# EasyEDA Pro project ProProject_AT32_FOC_2024-04-27.epro, board AT32_FOC
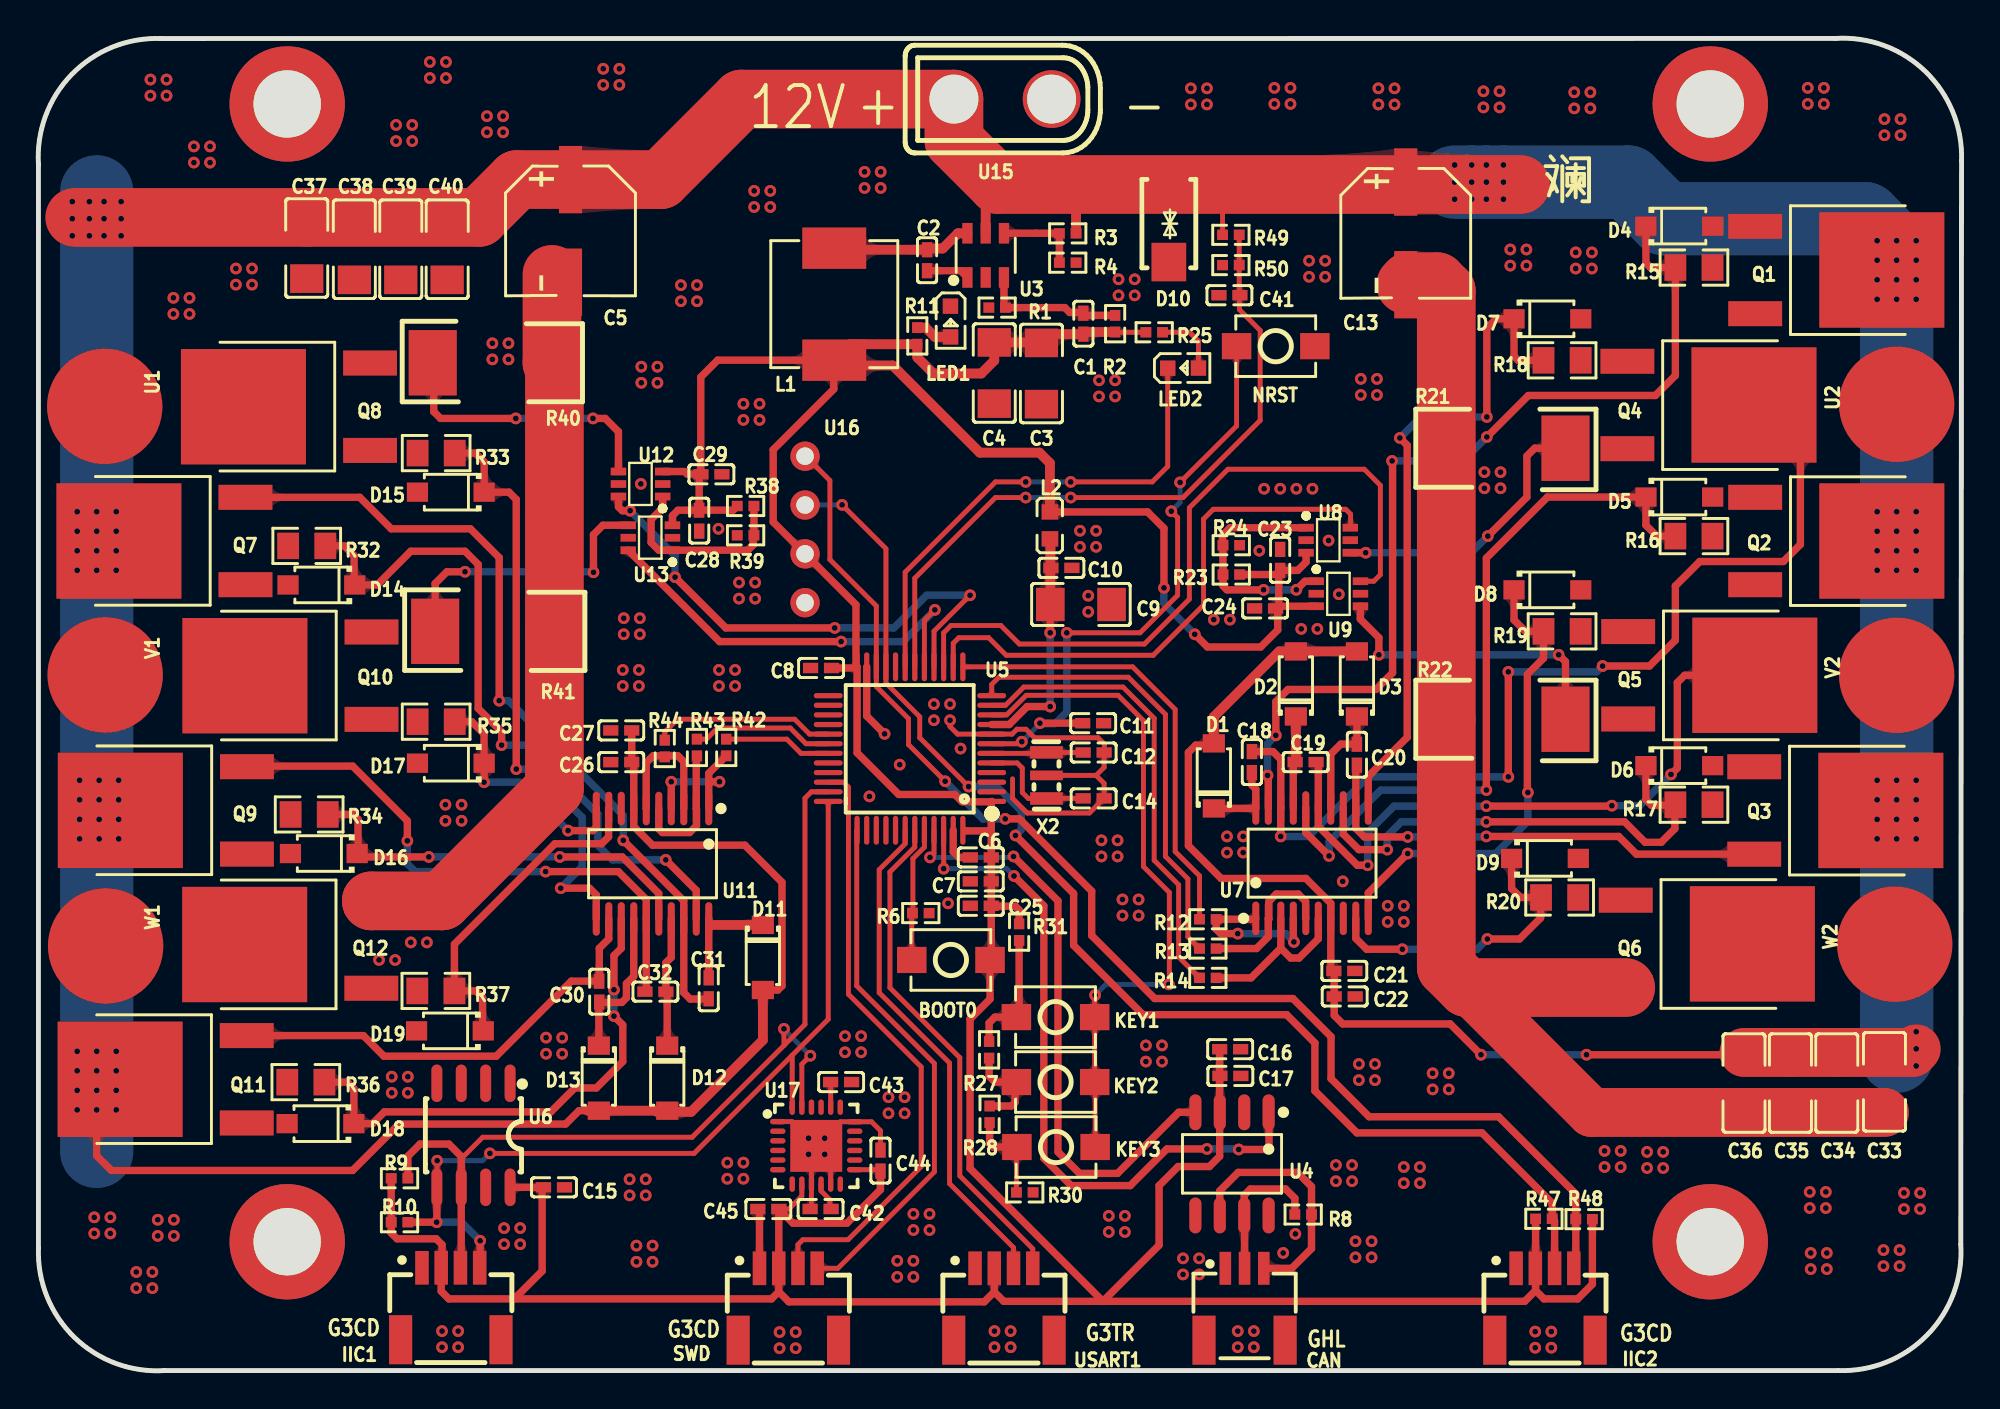
[diagram p6: board, top side]
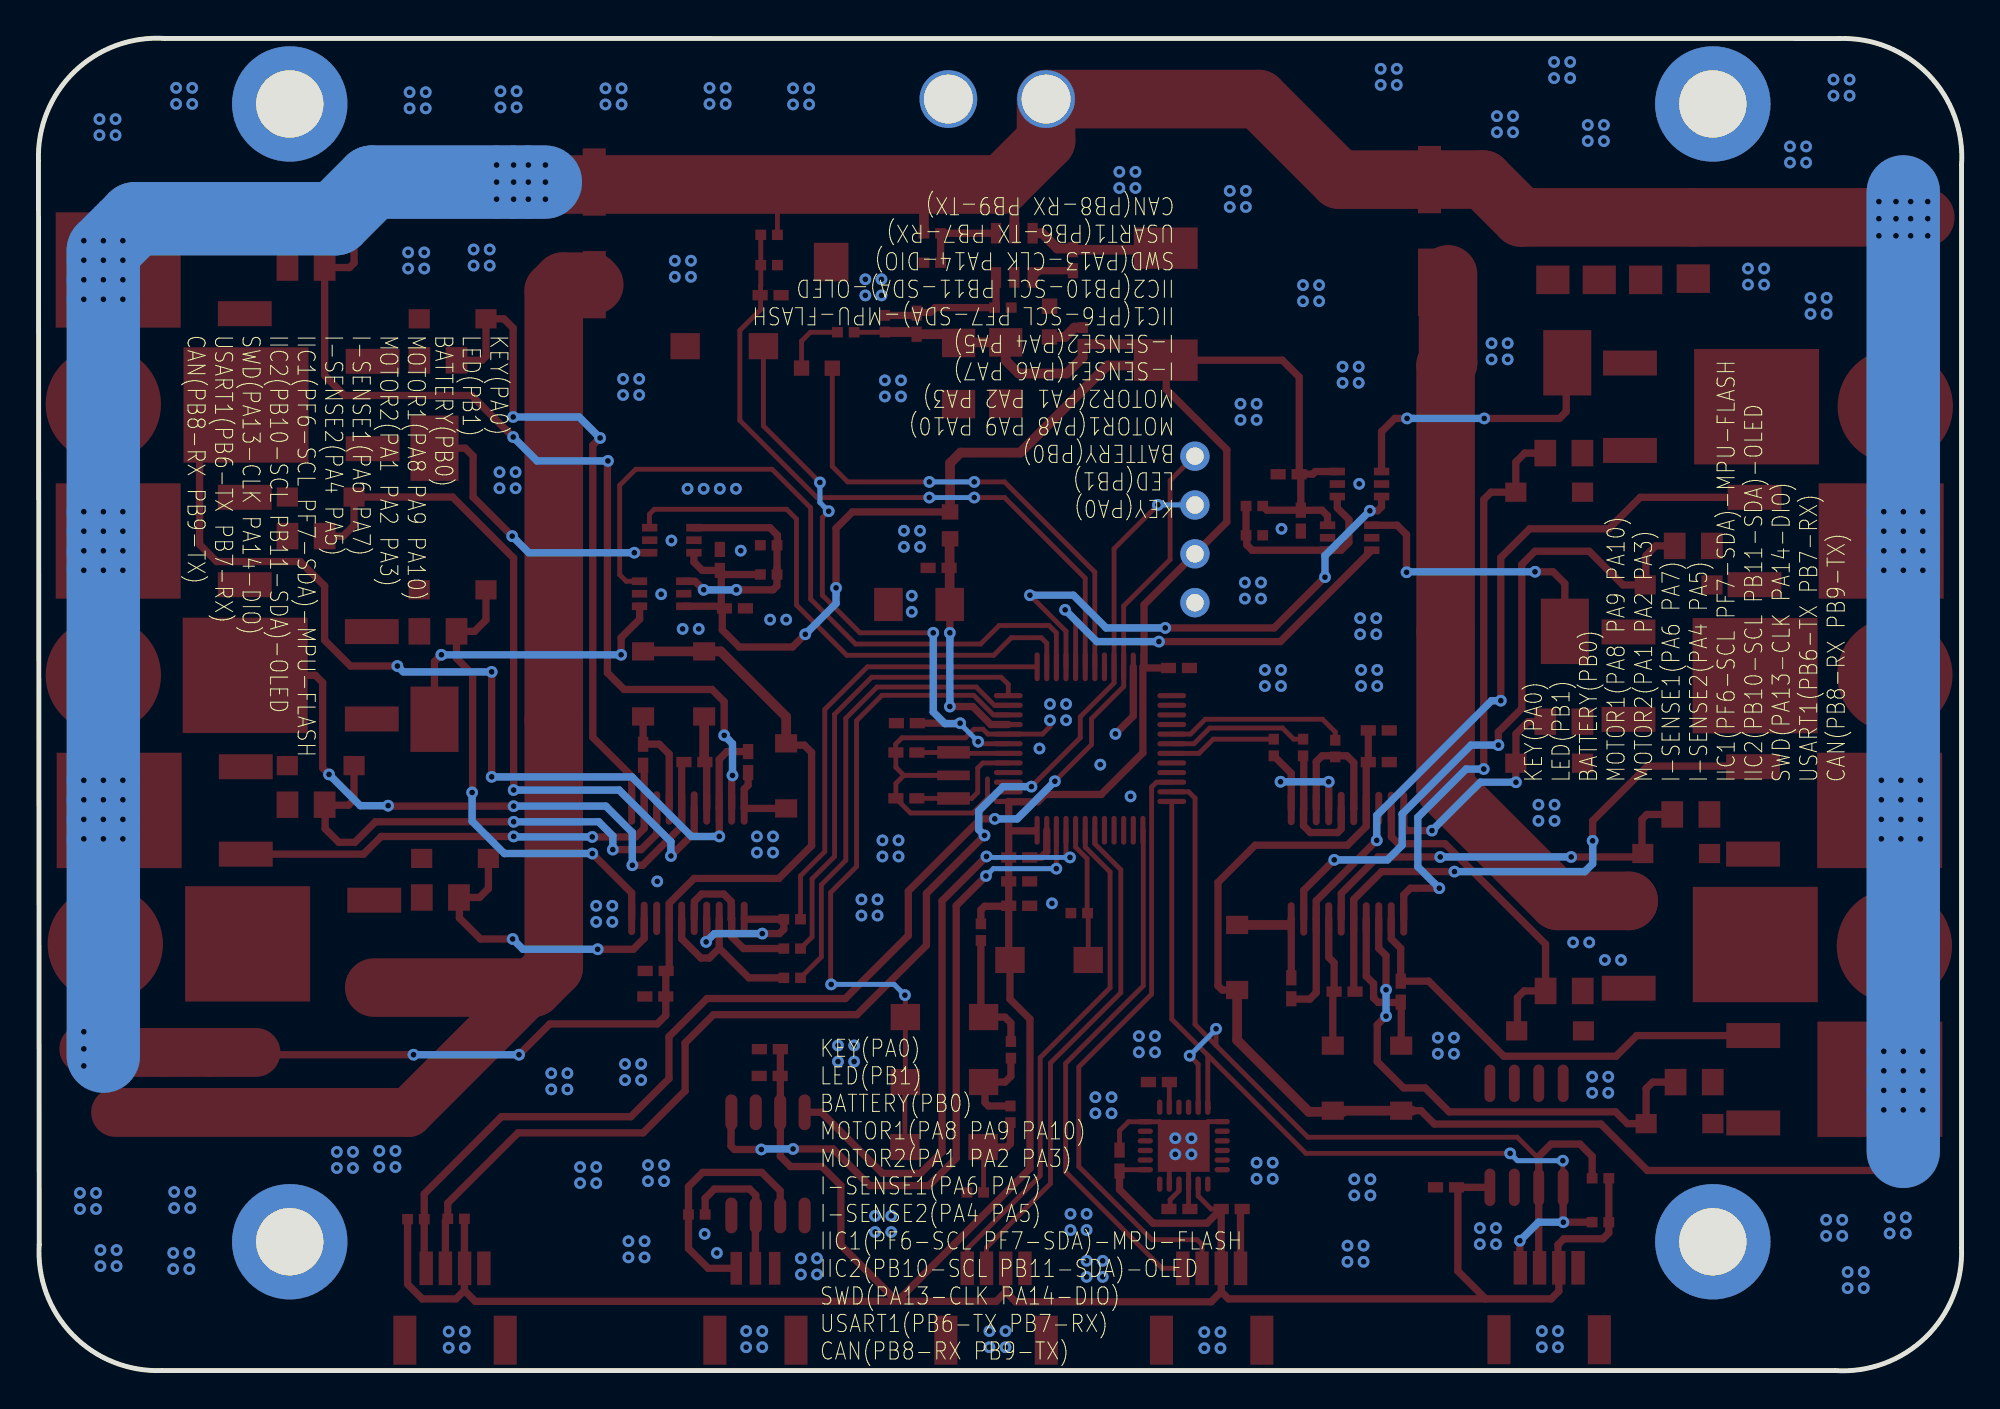
[diagram p7: board, bottom side, seen from below]

Outline 100 x 69.29 mm; copper layers: Top Layer, Bottom Layer. Coordinates in mm from the lower left corner of the outline.
Outline path: 0,62.72 0,6.37 arc(1.87,1.73) 6.56,0 93.59,0 arc(98.23,1.87) 99.96,6.56 100,62.92 arc(98.13,67.56) 93.44,69.29 6.37,69.29 arc(1.73,67.42) 0,62.72
Stack: Top Layer 0.035mm / Dielectric1 1.51mm FR4 er 4.5 / Bottom Layer 0.035mm

## Design rules (mm)
template: 自定义配置
spacing copperThickness1oz (default): track to track 0.102, other pairs 0.152 to 0.3
spacing copperThickness2oz: track to track 0.203, other pairs 0.152 to 0.3
track width copperThickness1oz (default): min 0.254, default 0.254, max 12.7
track width copperThickness2oz: min 0.254, default 0.254, max 12.7
differential pair differentialPair (default): width min 0.127, default 0.254, max 2.54; gap min 0.152, default 0.152
via viaSize (default): diameter min 0.5, default 0.61, max 10; hole min 0.3, default 0.305, max 6.299
pour e683 uses copperRegion1

## Placement (name value [footprint] x y rotation side)
BOOT0  K2-1807SN-A3DW-06  [SW-SMD_L4.0-W2.9-LS5.0]  47.45 21.36 0 top
C1  22pF  [C0402]  54.34 54.45 90 top
C2  22nF  [C0402]  46.21 57.75 90 top
C3  22uF  [C1206]  52.16 51.86 90 top
C4  22uF  [C1206]  49.7 51.89 90 top
C5  100uF  [CAP-SMD_BD6.3-L6.6-W6.6-LS7.2-FD]  27.67 59.28 270 top
C6  100nF  [C0402]  49 26.69 0 top
C7  100nF  [C0402]  49 25.44 0 top
C8  100nF  [C0402]  40.7 36.55 0 top
C9  10uF  [C1206]  54.21 39.85 180 top
C10  100nF  [C0402]  53.19 41.75 180 top
C11  100nF  [C0402]  54.84 33.67 180 top
C12  22pF  [C0402]  54.87 32.15 0 top
C13  100uF  [CAP-SMD_BD6.3-L6.6-W6.6-LS7.2-FD]  71.1 59.15 270 top
C14  22pF  [C0402]  54.87 29.76 180 top
C15  100nF  [C0402]  26.81 9.53 0 top
C16  10uF  [C0402]  61.97 16.72 180 top
C17  100nF  [C0402]  61.98 15.32 180 top
C18  1uF  [C0402]  63.1 31.65 270 top
C19  1uF  [C0402]  65.89 31.65 180 top
C20  1uF  [C0402]  68.56 32.03 90 top
C21  1uF  [C0402]  67.9 20.79 180 top
C22  100nF  [C0402]  67.92 19.46 180 top
C23  100nF  [C0402]  64.57 42.17 90 top
C24  100nF  [C0402]  63.78 39.64 180 top
C25  100nF  [C0402]  49 24.17 0 top
C26  1uF  [C0402]  30.3 31.65 0 top
C27  100nF  [C0402]  30.3 33.3 0 top
C28  100nF  [C0402]  34.36 44.21 270 top
C29  100nF  [C0402]  34.99 46.62 0 top
C30  1uF  [C0402]  29.16 19.71 270 top
C31  1uF  [C0402]  34.85 19.88 90 top
C32  1uF  [C0402]  32.08 19.71 0 top
C33  47uF  [C1206]  95.99 15.02 270 top
C34  47uF  [C1206]  93.52 14.95 270 top
C35  47uF  [C1206]  91.1 14.95 270 top
C36  47uF  [C1206]  88.69 14.95 270 top
C37  47uF  [C1206]  13.95 58.39 270 top
C38  47uF  [C1206]  16.43 58.33 270 top
C39  47uF  [C1206]  18.84 58.33 270 top
C40  47uF  [C1206]  21.25 58.33 270 top
C41  100nF  [C0402]  61.93 55.93 0 top
C42  100nF  [C0402]  40.67 8.4 180 top
C43  2.2nF  [C0402]  41.74 15.01 180 top
C44  10nF  [C0402]  43.78 10.92 90 top
C45  100nF  [C0402]  37.95 8.4 0 top
CAN  CAN  [CONN-SMD_AFC10-S03QCA-00]  62.72 3.45 180 top
D1  DSK34  [SOD-123_L2.8-W1.8-LS3.7-RD]  61.12 30.93 90 top
D2  DSK34  [SOD-123_L2.8-W1.8-LS3.7-RD]  65.39 35.71 90 top
D3  DSK34  [SOD-123_L2.8-W1.8-LS3.7-RD]  68.56 35.71 90 top
D4  1N4148W  [SOD-123F_L2.7-W1.6-LS3.8-RD]  85.32 59.53 0 top
D5  1N4148W  [SOD-123F_L2.7-W1.6-LS3.8-RD]  85.32 45.44 0 top
D6  1N4148W  [SOD-123F_L2.7-W1.6-LS3.8-RD]  85.32 31.46 0 top
D7  1N4148W  [SOD-123F_L2.7-W1.6-LS3.8-RD]  78.47 54.71 0 top
D8  1N4148W  [SOD-123F_L2.7-W1.6-LS3.8-RD]  78.47 40.61 0 top
D9  1N4148W  [SOD-123F_L2.7-W1.6-LS3.8-RD]  78.34 26.64 0 top
D10  SMAJ12CA/TR13  [SMA_L4.4-W2.6-LS5.0-BI]  58.78 59.66 90 top
D11  DSK34  [SOD-123_L2.8-W1.8-LS3.7-RD]  37.67 21.49 270 top
D12  DSK34  [SOD-123_L2.8-W1.8-LS3.7-RD]  32.7 15.21 270 top
D13  DSK34  [SOD-123_L2.8-W1.8-LS3.7-RD]  29.14 15.21 270 top
D14  1N4148W  [SOD-123F_L2.7-W1.6-LS3.8-RD]  14.71 40.86 180 top
D15  1N4148W  [SOD-123F_L2.7-W1.6-LS3.8-RD]  21.44 45.69 180 top
D16  1N4148W  [SOD-123F_L2.7-W1.6-LS3.8-RD]  14.84 26.89 180 top
D17  1N4148W  [SOD-123F_L2.7-W1.6-LS3.8-RD]  21.44 31.59 180 top
D18  1N4148W  [SOD-123F_L2.7-W1.6-LS3.8-RD]  14.67 12.84 180 top
D19  1N4148W  [SOD-123F_L2.7-W1.6-LS3.8-RD]  21.4 17.67 180 top
IIC1  IIC1  [CONN-SMD_AFC10-S04QCA-00]  21.44 3.47 0 top
IIC2  IIC2  [CONN-SMD_AFC10-S04QCA-00]  78.34 3.45 0 top
KEY1  K2-1807SN-A3DW-06  [SW-SMD_L4.0-W2.9-LS5.0]  52.89 18.38 180 top
KEY2  K2-1807SN-A3DW-06  [SW-SMD_L4.0-W2.9-LS5.0]  52.89 15.01 180 top
KEY3  K2-1807SN-A3DW-06  [SW-SMD_L4.0-W2.9-LS5.0]  52.91 11.63 180 top
L1  6.8uH  [IND-SMD_L7.1-W6.6]  41.38 55.47 270 top
L2  3.3uH  [L0603]  52.6 43.96 90 top
LED1  XL-1608UBC-04  [LED0603-RD_BLUE]  47.43 54.56 270 top
LED2  XL-1608UBC-04  [LED0603-RD_BLUE]  59.52 52.14 0 top
NOREF  -  [Pad_e193]  86.93 6.7 0 top
NOREF#2  -  [Pad_e173]  12.93 65.88 0 top
NOREF#3  -  [Pad_e194]  86.93 65.88 0 top
NOREF#4  -  [Pad_e174]  12.93 6.7 0 top
NRST  K2-1807SN-A3DW-06  [SW-SMD_L4.0-W2.9-LS5.0]  64.34 53.28 0 top
Q1  NCE3080K  [TO-252-2_L6.6-W6.1-P4.57-LS9.9-TL-CW]  92.56 57.25 0 top
Q2  NCE3080K  [TO-252-2_L6.6-W6.1-P4.57-LS9.9-TL-CW]  92.56 43.15 0 top
Q3  NCE3080K  [TO-252-2_L6.6-W6.1-P4.57-LS9.9-TL-CW]  92.51 29.13 0 top
Q4  NCE3080K  [TO-252-2_L6.6-W6.1-P4.57-LS9.9-TL-CW]  85.92 50.22 0 top
Q5  NCE3080K  [TO-252-2_L6.6-W6.1-P4.57-LS9.9-TL-CW]  85.96 36.16 0 top
Q6  NCE3080K  [TO-252-2_L6.6-W6.1-P4.57-LS9.9-TL-CW]  85.83 22.19 0 top
Q7  NCE3080K  [TO-252-2_L6.6-W6.1-P4.57-LS9.9-TL-CW]  7.47 43.15 180 top
Q8  NCE3080K  [TO-252-2_L6.6-W6.1-P4.57-LS9.9-TL-CW]  13.95 50.13 180 top
Q9  NCE3080K  [TO-252-2_L6.6-W6.1-P4.57-LS9.9-TL-CW]  7.55 29.14 180 top
Q10  NCE3080K  [TO-252-2_L6.6-W6.1-P4.57-LS9.9-TL-CW]  14.03 36.14 180 top
Q11  NCE3080K  [TO-252-2_L6.6-W6.1-P4.57-LS9.9-TL-CW]  7.54 15.15 180 top
Q12  NCE3080K  [TO-252-2_L6.6-W6.1-P4.57-LS9.9-TL-CW]  14.02 22.16 180 top
R1  22.1kΩ  [R0402]  49.85 55.29 180 top
R2  100kΩ  [R0402]  55.99 54.45 90 top
R3  20kΩ  [R0402]  53.52 59.15 0 top
R4  10kΩ  [R0402]  53.52 57.63 180 top
R6  10kΩ  [R0402]  45.88 23.79 180 top
R8  120Ω  [R0402]  65.77 8.12 0 top
R9  10kΩ  [R0402]  18.78 10 180 top
R10  10kΩ  [R0402]  18.78 7.72 180 top
R11  5.1kΩ  [R0402]  45.7 53.82 90 top
R12  100Ω  [R0402]  60.81 23.47 0 top
R13  100Ω  [R0402]  60.81 21.95 0 top
R14  100Ω  [R0402]  60.81 20.43 0 top
R15  10Ω  [R0805_NEW]  86.09 57.37 0 top
R16  10Ω  [R0805_NEW]  86.09 43.4 0 top
R17  10Ω  [R0805_NEW]  86.09 29.43 0 top
R18  10Ω  [R0805_NEW]  79.23 52.55 0 top
R19  10Ω  [R0805_NEW]  79.23 38.45 0 top
R20  10Ω  [R0805_NEW]  79.1 24.61 0 top
R21  5mΩ  [RES-SMD_L6.4-W3.2-1]  76.31 47.97 0 top
R22  5mΩ  [RES-SMD_L6.4-W3.2-1]  76.31 33.88 0 top
R23  1kΩ  [R0402]  62.03 41.4 180 top
R24  1kΩ  [R0402]  62.03 42.93 0 top
R25  5.1kΩ  [R0402]  58.02 54.01 0 top
R27  2kΩ  [R0402]  49.43 16.68 90 top
R28  2kΩ  [R0402]  49.46 13.33 90 top
R30  2kΩ  [R0402]  51.29 9.27 180 top
R31  2kΩ  [R0402]  50.99 22.8 90 top
R32  10Ω  [R0805_NEW]  13.95 42.89 180 top
R33  10Ω  [R0805_NEW]  20.68 47.72 180 top
R34  10Ω  [R0805_NEW]  14.08 28.92 180 top
R35  10Ω  [R0805_NEW]  20.68 33.75 180 top
R36  10Ω  [R0805_NEW]  13.9 15 180 top
R37  10Ω  [R0805_NEW]  20.66 19.75 180 top
R38  1kΩ  [R0402]  36.77 44.97 0 top
R39  1kΩ  [R0402]  36.77 43.45 180 top
R40  5mΩ  [RES-SMD_L6.4-W3.2-1]  23.6 52.42 180 top
R41  5mΩ  [RES-SMD_L6.4-W3.2-1]  23.73 38.45 180 top
R42  100Ω  [R0402]  35.77 32.41 270 top
R43  100Ω  [R0402]  34.24 32.41 270 top
R44  100Ω  [R0402]  32.57 32.35 270 top
R47  10kΩ  [R0402]  78.28 7.89 180 top
R48  10kΩ  [R0402]  80.37 7.87 0 top
R49  91kΩ  [R0402]  62.01 59.07 0 top
R50  10kΩ  [R0402]  62.01 57.5 180 top
SWD  SWD  [CONN-SMD_AFC10-S04QCA-00]  38.99 3.45 0 top
U1  PAD  [PAD-1.5]  3.45 50.15 270 top
U2  PAD  [PAD-1.5]  96.63 50.26 270 top
U3  MT2492  [SOT-23-6_L2.9-W1.6-P0.95-LS2.8-BL]  49.26 58.01 0 top
U4  SIT65HVD230DR  [SOP-8_L4.9-W3.9-P1.27-LS6.0-BL]  62.07 10.75 180 top
U5  AT32F415CBT7  [LQFP-48_L7.0-W7.0-P0.50-LS9.0-BL]  45.32 32.35 90 top
U6  AT24C02C-SSHM-T  [SOIC-8_L5.0-W4.0-P1.27-LS6.0-BL]  22.62 12.24 180 top
U7  EG2133  [TSSOP-20_L6.5-W4.4-P0.65-LS6.4-BL]  66.23 26.39 0 top
U8  TP181A1-CR  [SC70-6_L2.1-W1.3-P0.65-LS2.3-BL]  67.07 43.19 270 top
U9  TP181A1-CR  [SC70-6_L2.1-W1.3-P0.65-LS2.3-BL]  67.59 40.41 270 top
U11  EG2133  [TSSOP-20_L6.5-W4.4-P0.65-LS6.4-BL]  31.93 26.36 180 top
U12  TP181A1-CR  [SC70-6_L2.1-W1.3-P0.65-LS2.3-BL]  31.31 46.11 90 top
U13  TP181A1-CR  [SC70-6_L2.1-W1.3-P0.65-LS2.3-BL]  31.82 43.32 90 top
U15  XT30  [XT-30]  50.14 66.14 0 top
U16  -  [OLED-0.91-2.54*4P-IIC]  56.65 44.8 0 top
U17  MPU-6050  [QFN-24_L4.0-W4.0-P0.50-BL-EP2.7]  40.45 11.7 270 top
USART1  USART1  [CONN-SMD_AFC10-S04QCA-00]  50.2 3.45 0 top
V1  PAD  [PAD-1.5]  3.47 36.18 90 top
V2  PAD  [PAD-1.5]  96.63 36.16 270 top
W1  PAD  [PAD-1.5]  3.49 22.08 270 top
W2  PAD  [PAD-1.5]  96.53 22.18 90 top
X2  8MHz  [OSC-SMD_3P-L3.2-W1.3-P1.2-L]  52.42 30.96 90 top

## Footprints (pads in the part's own frame, mm; a bottom-side part is the same pattern mirrored in y, then rotated)
C0402
  rect 0.79x0.54 smd: 1(-0.545,0) 2(0.545,0)
C1206
  rect 1.485x1.728 smd: 1(-1.593,0) 2(1.593,0)
CAP-SMD_BD6.3-L6.6-W6.6-LS7.2-FD
  rect 3.5x1.2 smd: 1(-2.67,0) 2(2.67,0)
CONN-SMD_AFC10-S03QCA-00
  rect 0.6x1.71 smd: 1(1,-1.87) 2(0,-1.87) 3(-1,-1.87)
  rect 1.2x2.55 smd: 4(-2.11,1.87) 5(2.11,1.87)
CONN-SMD_AFC10-S04QCA-00
  rect 0.7x1.75 smd: 1(-1.5,1.87) 2(-0.5,1.87) 3(0.5,1.87) 4(1.5,1.87)
  rect 1.2x2.55 smd: 5(-2.61,-1.87) 6(2.61,-1.87)
IND-SMD_L7.1-W6.6
  rect 2.15x3.32 smd: 1(-2.913,0) 2(2.913,0)
L0603
  rect 0.8x0.864 smd: 1(-0.7,0) 2(0.7,0)
LED0603-RD_BLUE
  rect 0.8x0.8 smd: 1(-0.799,-0.004) 2(0.799,0.004)
LQFP-48_L7.0-W7.0-P0.50-LS9.0-BL
  oval 0.27x1.5 smd: 1(-2.75,-4.25) 2(-2.25,-4.25) 3(-1.75,-4.25) 4(-1.25,-4.25) 5(-0.75,-4.25) 6(-0.25,-4.25) 7(0.25,-4.25) 8(0.75,-4.25) 9(1.25,-4.25) 10(1.75,-4.25) 11(2.25,-4.25) 12(2.75,-4.25) 25(2.75,4.25) 26(2.25,4.25) 27(1.75,4.25) 28(1.25,4.25) 29(0.75,4.25) 30(0.25,4.25) 31(-0.25,4.25) 32(-0.75,4.25) 33(-1.25,4.25) 34(-1.75,4.25) 35(-2.25,4.25) 36(-2.75,4.25)
  oval 1.5x0.27 smd: 13(4.25,-2.75) 14(4.25,-2.25) 15(4.25,-1.75) 16(4.25,-1.25) 17(4.25,-0.75) 18(4.25,-0.25) 19(4.25,0.25) 20(4.25,0.75) 21(4.25,1.25) 22(4.25,1.75) 23(4.25,2.25) 24(4.25,2.75) 37(-4.25,2.75) 38(-4.25,2.25) 39(-4.25,1.75) 40(-4.25,1.25) 41(-4.25,0.75) 42(-4.25,0.25) 43(-4.25,-0.25) 44(-4.25,-0.75) 45(-4.25,-1.25) 46(-4.25,-1.75) 47(-4.25,-2.25) 48(-4.25,-2.75)
OLED-0.91-2.54*4P-IIC
  round 1.524 hole 0.909: 1(-16.792,-4.859) 2(-16.792,-2.319) 3(-16.792,0.221) 4(-16.792,2.761)
OSC-SMD_3P-L3.2-W1.3-P1.2-L
  rect 0.65x1.7 smd: 1(-1.2,0) 3(1.2,0)
  rect 0.5x1.7 smd: 2(0,0)
PAD-1.5
  rrect 6x6 smd: 1(0,0)
Pad_e173
  round 6 hole 3.5: 1(0,0)
Pad_e174
  round 6 hole 3.5: 1(0,0)
Pad_e193
  round 6 hole 3.5: 1(0,0)
Pad_e194
  round 6 hole 3.5: 1(0,0)
QFN-24_L4.0-W4.0-P0.50-BL-EP2.7
  oval 0.28x0.8 smd: 1(-1.25,-2) 2(-0.75,-2) 3(-0.25,-2) 4(0.25,-2) 5(0.75,-2) 6(1.25,-2) 13(1.25,2) 14(0.75,2) 15(0.25,2) 16(-0.25,2) 17(-0.75,2) 18(-1.242,2)
  oval 0.8x0.28 smd: 7(2,-1.25) 8(2,-0.75) 9(2,-0.25) 10(2,0.25) 11(2,0.75) 12(2,1.25) 19(-2,1.25) 20(-2,0.75) 21(-2,0.25) 22(-2,-0.25) 23(-2,-0.75) 24(-2,-1.25)
  rect 2.7x2.7 smd: 25(0.013,0)
R0402
  rect 0.566x0.54 smd: 1(-0.433,0) 2(0.433,0)
R0805_NEW
  rect 1.133x1.377 smd: 1(-0.966,0) 2(0.966,0)
RES-SMD_L6.4-W3.2-1
  rect 2.5x3.4 smd: 1(-3.1,0) 2(3.1,0)
SC70-6_L2.1-W1.3-P0.65-LS2.3-BL
  rect 0.4x0.8 smd: 1(-0.65,-1.15) 2(-0.001,-1.15) 3(0.65,-1.15) 4(0.65,1.15) 5(0,1.15) 6(-0.65,1.15)
SMA_L4.4-W2.6-LS5.0-BI
  rect 2x1.8 smd: 1(-2,0) 2(2,0)
SOD-123_L2.8-W1.8-LS3.7-RD
  rect 0.95x1.15 smd: 1(-1.692,0) 2(1.692,0)
SOD-123F_L2.7-W1.6-LS3.8-RD
  rect 1.1x1 smd: 1(-1.735,0) 2(1.735,0)
SOIC-8_L5.0-W4.0-P1.27-LS6.0-BL
  oval 0.569x1.95 smd: 1(-1.905,-2.705) 2(-0.635,-2.705) 3(0.635,-2.705) 4(1.905,-2.705) 5(1.905,2.705) 6(0.635,2.705) 7(-0.635,2.705) 8(-1.905,2.705)
SOP-8_L4.9-W3.9-P1.27-LS6.0-BL
  oval 0.63x1.865 smd: 1(-1.905,-2.683) 2(-0.635,-2.683) 3(0.635,-2.683) 4(1.905,-2.683) 5(1.905,2.683) 6(0.635,2.683) 7(-0.635,2.683) 8(-1.905,2.683)
SOT-23-6_L2.9-W1.6-P0.95-LS2.8-BL
  rect 0.532x1.072 smd: 1(-0.95,-1.149) 2(0,-1.149) 3(0.95,-1.149) 4(0.95,1.149) 5(0,1.149) 6(-0.95,1.149)
SW-SMD_L4.0-W2.9-LS5.0
  rect 1.53x1.36 smd: 1(-2.035,0) 2(2.035,0)
TO-252-2_L6.6-W6.1-P4.57-LS9.9-TL-CW
  rect 2.8x1.3 smd: 1(-3.292,2.273) 3(-3.292,-2.273)
  rect 6.5x6 smd: 2(3.292,0)
TSSOP-20_L6.5-W4.4-P0.65-LS6.4-BL
  oval 0.364x1.742 smd: 1(-2.925,-2.871) 2(-2.275,-2.871) 3(-1.625,-2.871) 4(-0.975,-2.871) 5(-0.325,-2.871) 6(0.325,-2.871) 7(0.975,-2.871) 8(1.625,-2.871) 9(2.275,-2.871) 10(2.925,-2.871) 11(2.925,2.871) 12(2.275,2.871) 13(1.625,2.871) 14(0.975,2.871) 15(0.325,2.871) 16(-0.325,2.871) 17(-0.975,2.871) 18(-1.625,2.871) 19(-2.275,2.871) 20(-2.925,2.871)
XT-30
  round 3 hole 2.54: 1(-2.54,0) 2(2.54,0)

## Nets
As in the schematic.

Pads without a net: NOREF 1; NOREF#2 1; NOREF#3 1; NOREF#4 1; U4 5; U5 2 3 4 20 25 26 27 28 32 33 38 39 40 41; U17 2 3 4 5 6 7 12 14 15 16 17 19 21 22

## Via types
v1: diameter 0.61, hole 0.305, Top Layer to Bottom Layer, 506 vias

## Routing (per net, layer and track width the routed paths; a pad name or vN(x,y) marks a point on that pad's centre or on a via; arc(x,y) is an arc through that point)
3V3: length 266.1
  Top Layer w0.254: R2.1 56,54.01 R25.1 ; U17.13 43.71,10.45 C44.1 ; C45.2 39.02,8.4 39.7,9.08 U17.8
  Top Layer w0.381: 77.85,5.33 77.85,4.16 ; 77.85,5.33 IIC2.2 ; 77.85,5.33 R47.2 ; 77.85,4.16 78.29,3.73 80.04,3.73 80.81,4.49 R48.2 ; 77.85,4.16 77.29,3.6 55.35,3.6 ; 49.7,4.09 50.2,3.6 55.35,3.6 ; 49.7,4.09 USART1.2 ; 49.7,4.09 49.19,3.58 39.02,3.58 38.49,4.1 ; 24.74,3.73 38.12,3.73 38.49,4.1 ; 24.74,3.73 21.34,3.73 20.94,4.13 20.94,5.34 20.99,5.39 20.99,6.55 20.68,6.85 18.65,6.85 18.34,7.16 R10.2 R9.2 ; 24.74,3.73 26.19,5.18 26.19,9.46 C15.1 U6.8 ; C25.2 49.57,24.15 50.81,24.15 50.99,23.96 R31.2 ; C25.2 49.55,21.42 BOOT0.2 49.48,19.32 48.44,18.28 48.44,10.51 55.35,3.6 ; C25.2 C7.2 C6.2 49.55,28.07 ; 49.55,28.07 49.55,29.46 ; 49.55,28.07 48.21,28.07 48.19,28.1 ; 64.5,41.55 64.5,39.81 64.44,39.76 ; 64.5,41.55 64.35,41.4 R23.1 ; 64.5,41.55 C23.1 65.48,41.62 65.92,42.06 U8.3 ; 64.44,39.76 C24.1 ; 64.44,39.76 U9.3 ; 64.44,39.76 64.44,38.52 63.56,37.64 60.79,37.64 v1(60.13,38.3) ; R38.1 36.12,44.75 C28.1 ; 55.35,3.6 58.27,6.52 58.27,9.62 59.26,10.61 60.89,10.61 61.42,11.15 61.42,13.44 ; C28.1 34.36,46.53 C29.1 34.44,46.63 ; C28.1 34.36,44.75 33.25,44.75 32.97,44.46 U13.3 ; C44.1 43.78,9.41 42.04,7.66 39.23,7.66 C45.2 38.5,5.32 SWD.2 38.49,4.1 ; C8.2 42.51,36.55 ; 42.51,36.55 42.51,39.83 U16.2 38.21,44.14 38.21,47.9 41.36,51.05 41.36,52.53 L1.2 35.32,52.55 34.44,51.68 34.44,46.63 ; 42.51,36.55 U5.24 42.57,32.13 44.73,29.97 47.65,29.97 48.03,29.59 49.55,29.59 U5.1 ; 34.44,46.63 33.74,46.63 33.6,46.76 U12.3 ; v1(58.53,40.71) 58.53,43.81 57.67,44.66 52.6,44.66 ; C16.2 61.42,13.44 ; 61.42,13.44 U4.3
  Top Layer w0.508: R2.1 54.45,54.02 C1.1 52.61,53.91 52.16,53.45 52.13,53.48 C4.2 49.7,52.54 49.03,51.86 46.54,51.86 45.7,52.7 R11.1 42.21,53.38 L1.2 41.38,52.28 44.42,52.28 48.95,47.75 52.05,47.75 52.6,47.2 52.6,44.66
  Bottom Layer w0.381: v1(58.53,40.71) 58.53,39.9 v1(60.13,38.3)
3V3EN: length 4.4
  Top Layer w0.381: 51.86,59.16 53.08,59.16 53.09,59.15 53.09,57.63 ; 51.86,59.16 U3.4 ; 51.86,59.16 51.87,59.15
GND: length 154
  Top Layer w0.254: 55,30.96 55.41,30.54 C14.1 54.65,29 51.42,29 50.65,29.76 50.65,30.78 ; 55,30.96 X2.2 ; 55,30.96 55.41,31.38 C12.2 55.43,32.16 55.43,32.58 55.1,32.91 51.8,32.91 51.35,33.36 50.88,33.36 50.63,33.1 U5.8 47.79,33.1 47.4,33.5 v1(47.4,33.83) ; U17.11 41.2,10.94 v1(40.88,11.25) U17.25 ; U17.25 v1(40.05,12.09) 39.18,12.95 U17.1 ; U17.25 41.7,12.94 U17.18 43.32,12.94 43.78,12.48 43.78,11.47 ; U17.25 40.2,11.44 U17.9 40.2,8.47 40.13,8.4
  Top Layer w0.381: C6.1 47.86,26.69 47.57,26.98 U5.47 ; C45.1 37.49,8.31 SWD.1 ; U5.23 43.07,34.05 v1(44,33.12)
  Top Layer w2.54: 74.26,19.92 80.76,13.43 C33.2
  Top Layer w3.048: 26.7,57.02 R40.1 26.83,52.29 R41.1 26.83,30.27 20.99,24.43 17.31,24.43 Q12.3 ; C13.2 71.26,56.64 72.73,56.64 73.21,56.16 R21.1 R22.1 73.21,20.98 74.26,19.92 Q6.3
  vias: v1(2.9,7.97) v1(2.9,7.13) v1(3.74,7.97) v1(3.74,7.13) v1(5.09,5.12) v1(5.09,4.29) v1(5.82,67.15) v1(5.82,66.31) v1(5.92,5.12) v1(5.92,4.29) v1(6.2,7.84) v1(6.2,7) v1(6.66,67.15) v1(6.66,66.31) v1(7.02,55.8) v1(7.02,54.96) v1(7.04,7.84) v1(7.04,7) v1(7.85,55.8) v1(7.85,54.96) v1(8.08,63.67) v1(8.08,62.83) v1(8.92,63.67) v1(8.92,62.83) v1(10.27,57.32) v1(10.27,56.48) v1(11.1,57.32) v1(11.1,56.48) v1(17.71,21.36) v1(18.37,15.28) v1(18.37,14.45) v1(18.55,21.36) v1(18.6,64.79) v1(18.6,63.95) v1(19.21,15.28) v1(19.21,14.45) v1(19.36,22.27) v1(19.44,64.79) v1(19.44,63.95) v1(20.2,22.27) v1(20.35,68.07) v1(20.35,67.23) v1(20.99,2.05) v1(20.99,1.21) v1(21.19,68.07) v1(21.19,67.23) v1(21.16,29.43) v1(21.16,28.59) v1(21.82,2.05) v1(21.82,1.21) v1(22,29.43) v1(22,28.59) v1(23.32,65.25) v1(23.32,64.41) v1(23.6,53.43) v1(23.6,52.6) v1(24.16,65.25) v1(24.16,64.41) v1(24.21,7.41) v1(24.21,6.57) v1(24.44,53.43) v1(24.44,52.6) v1(25.05,7.41) v1(25.05,6.57) v1(26.4,17.32) v1(26.4,16.48) v1(27.23,17.32) v1(27.23,16.48) v1(29.37,67.71) v1(29.37,66.87) v1(30.21,67.71) v1(30.21,66.87) v1(30.38,36.44) v1(30.38,35.6) v1(30.43,39.14) v1(30.43,38.3) v1(30.74,9.95) v1(30.74,9.11) v1(31.09,6.5) v1(31.09,5.66) v1(31.27,39.14) v1(31.27,38.3) v1(31.22,36.44) v1(31.22,35.6) v1(31.35,52.22) v1(31.35,51.38) v1(31.32,46.12) v1(31.58,9.95) v1(31.58,9.11) v1(31.93,6.5) v1(31.93,5.66) v1(32.19,52.22) v1(32.19,51.38) v1(33.41,56.46) v1(33.41,55.62) v1(34.24,56.46) v1(34.24,55.62) v1(35.36,43.78) v1(35.39,36.44) v1(35.39,35.6) v1(35.82,10.81) v1(35.82,9.98) v1(36.23,36.44) v1(36.23,35.6) v1(36.43,40.99) v1(36.43,40.15) v1(36.66,50.29) v1(36.66,49.45) v1(36.66,10.81) v1(36.66,9.98) v1(37.22,61.36) v1(37.22,60.52) v1(37.27,40.99) v1(37.27,40.15) v1(37.5,50.29) v1(37.5,49.45) v1(38.05,61.36) v1(38.05,60.52) v1(38.54,2) v1(38.54,1.16) v1(39.38,2) v1(39.38,1.16) v1(40.05,11.25) v1(40.88,12.09) v1(41.94,17.39) v1(41.94,16.55) v1(42.78,17.39) v1(42.78,16.55) v1(42.96,62.35) v1(42.96,61.51) v1(43.21,29.86) v1(43.8,62.35) v1(43.8,61.51) v1(44.2,14.22) v1(44.2,13.38) v1(44.66,5.71) v1(44.66,4.87) v1(44.79,31.52) v1(45.04,14.22) v1(45.04,13.38) v1(45.5,8.15) v1(45.5,7.31) v1(45.5,5.71) v1(45.5,4.87) v1(46.33,8.15) v1(46.33,7.31) v1(46.56,34.67) v1(46.56,33.83) v1(47.3,24.3) v1(47.4,34.67) v1(47.95,32.35) v1(49.71,2.05) v1(49.71,1.21) v1(50.55,2.05) v1(50.55,1.21) v1(54.16,43.68) v1(54.16,42.84) v1(54.59,40.3) v1(54.59,39.47) v1(55,43.68) v1(55,42.84) v1(55.15,51.51) v1(55.15,50.67) v1(55.28,27.58) v1(55.28,26.74) v1(55.66,8.05) v1(55.66,7.21) v1(55.99,51.51) v1(55.99,50.67) v1(56.17,56.76) v1(56.17,55.92) v1(56.11,27.58) v1(56.11,26.74) v1(56.37,24.51) v1(56.37,23.67) v1(56.49,8.05) v1(56.49,7.21) v1(57,56.76) v1(57,55.92) v1(57.21,24.51) v1(57.21,23.67) v1(57.59,16.91) v1(57.59,16.07) v1(58.43,16.91) v1(58.43,16.07) v1(59.52,5.84) v1(59.52,5) v1(59.92,66.69) v1(59.92,65.86) v1(60.36,5.84) v1(60.36,5) v1(60.76,66.69) v1(60.76,65.86) v1(61.12,39.06) v1(61.8,27.78) v1(61.8,26.94) v1(61.96,39.06) v1(62.36,2.05) v1(62.36,1.21) v1(62.64,27.78) v1(62.64,26.94) v1(63.2,2.05) v1(63.2,1.21) v1(63.48,42.65) v1(63.73,45.87) v1(64.27,66.72) v1(64.27,65.88) v1(64.57,45.87) v1(64.72,6.12) v1(65.11,66.72) v1(65.11,65.88) v1(65.36,7.11) v1(65.41,45.87) v1(65.66,38.58) v1(66.07,57.73) v1(66.07,56.89) v1(66.25,45.87) v1(66.5,38.58) v1(66.91,57.73) v1(66.91,56.89) v1(67.09,43.17) v1(67.47,10.69) v1(67.47,9.85) v1(67.62,40.38) v1(67.82,25.44) v1(68.31,10.69) v1(68.31,9.85) v1(68.48,6.73) v1(68.48,5.89) v1(68.66,15.95) v1(68.66,15.11) v1(68.76,51.58) v1(68.76,50.74) v1(69.32,6.73) v1(69.32,5.89) v1(69.5,15.95) v1(69.5,15.11) v1(69.68,66.69) v1(69.68,65.86) v1(69.6,51.58) v1(69.6,50.74) v1(70.16,24.17) v1(70.16,23.34) v1(70.52,66.69) v1(70.52,65.86) v1(71,24.17) v1(71,23.34) v1(71,10.59) v1(71,9.75) v1(71.84,10.59) v1(71.84,9.75) v1(72.5,15.46) v1(72.5,14.62) v1(73.33,15.46) v1(73.33,14.62) v1(75.14,66.54) v1(75.14,65.7) v1(75.19,46.73) v1(75.19,45.89) v1(75.98,66.54) v1(75.98,65.7) v1(76.03,46.73) v1(76.03,45.89) v1(76.54,58.31) v1(76.54,57.47) v1(77.37,58.31) v1(77.37,57.47) v1(77.83,2.03) v1(77.83,1.19) v1(78.67,2.03) v1(78.67,1.19) v1(79.86,66.49) v1(79.86,65.65) v1(79.94,58.16) v1(79.94,57.32) v1(80.7,66.49) v1(80.7,65.65) v1(80.78,58.16) v1(80.78,57.32) v1(81.44,11.42) v1(81.44,10.59) v1(82.28,11.42) v1(82.28,10.59) v1(83.65,11.37) v1(83.65,10.54) v1(84.49,11.37) v1(84.49,10.54) v1(92,66.72) v1(92,65.88) v1(92.11,9.29) v1(92.11,8.45) v1(92.16,6.12) v1(92.16,5.28) v1(92.84,66.72) v1(92.84,65.88) v1(92.94,9.29) v1(92.94,8.45) v1(92.99,6.12) v1(92.99,5.28) v1(95.99,65.09) v1(95.99,64.26) v1(95.94,6.27) v1(95.94,5.43) v1(96.78,6.27) v1(96.78,5.43) v1(96.83,65.09) v1(96.83,64.26) v1(97.01,9.24) v1(97.01,8.4) v1(97.85,9.24) v1(97.85,8.4)
VDDA: length 12.2
  Top Layer w0.381: v1(52.61,38.37) 52.61,39.84 C9.2 ; U5.9 50.48,33.6 51.42,34.54 v1(52.61,34.54)
  Top Layer w0.508: 52.62,43.28 52.62,41.78 C10.2 52.62,41.72 C9.2
  Bottom Layer w0.381: v1(52.61,38.37) v1(52.61,34.54)
VIN: length 328.4
  Top Layer w0.254: R49.1 61.57,61.18
  Top Layer w0.381: v1(75.01,16.43) 73.41,18.03 67.82,18.03 67.38,18.47 C22.2 67.38,20.77 67.2,20.94 U7.7 67.2,24.3 65.91,25.6 61.5,25.6 59.8,27.3 59.8,32.15 60.18,32.53 61.03,32.53 D1.2 ; C27.2 C26.2 30.96,31.54 U11.7 30.96,28.3 31.93,27.32 36.73,27.32 38.66,25.39 38.66,20.01 38.45,19.79 D11.2 ; C36.1 88.57,16.43 v1(80.5,16.43) ; v1(3.03,13.56) 3.03,11.17 3.79,10.41 16.34,10.41 18.75,12.82 27.41,12.82 28.11,13.52 28.55,13.52
  Top Layer w0.508: 53.96,59.15 53.96,60.78 ; D1.2 61.12,34.01 64.52,37.41 65.38,37.41 D2.2 D3.2 ; 49.31,60.9 49.26,60.85 U3.5 ; 28.55,13.52 D13.2 32.11,13.52 32.17,13.46 33.94,13.46 37.67,17.19 D11.2 ; 52.74,60.78 52.63,60.88
  Top Layer w2.54: v1(97.64,16.73) 97.46,16.55 C34.1 C35.1 C36.1
  Top Layer w3.048: 77.07,61.69 49.89,61.69 47.61,63.98 U15.1 36.56,66.14 32.36,61.94 27.67,61.94 C5.1 24.88,61.95 22.91,59.98 C37.1 1.88,59.98
  Bottom Layer w0.381: v1(80.5,16.43) v1(75.01,16.43)
  Bottom Layer w3.81: 3.03,11.4 v1(3.03,13.56) v1(3.03,14.57) v1(3.03,15.59) v1(3.03,16.61) v1(3.03,41.62) v1(3.03,42.64) v1(3.03,43.66) v1(3.03,44.67) 3.03,61.31 ; v1(73.64,61.82) v1(74.53,61.82) v1(75.29,61.82) v1(76.18,61.82) 82.66,61.82 84.56,59.91 94.98,59.91 96.63,58.26 v1(96.63,57.75) v1(96.63,56.74) v1(96.63,55.72) v1(96.63,44.67) v1(96.63,43.66) v1(96.63,42.64) v1(96.63,41.62) v1(96.63,30.7) v1(96.63,29.69) v1(96.63,28.67) v1(96.63,27.66) 96.63,16.35
  vias: v1(1.76,60.8) v1(1.76,59.91) v1(1.76,59.02) v1(2.01,44.67) v1(2.01,43.66) v1(2.01,42.64) v1(2.01,41.62) v1(2.01,16.61) v1(2.01,15.59) v1(2.01,14.57) v1(2.01,13.56) v1(2.14,30.7) v1(2.14,29.69) v1(2.14,28.67) v1(2.14,27.66) v1(2.65,60.8) v1(2.65,59.91) v1(2.65,59.02) v1(3.16,30.7) v1(3.16,29.69) v1(3.16,28.67) v1(3.16,27.66) v1(3.41,60.8) v1(3.41,59.91) v1(3.41,59.02) v1(4.04,44.67) v1(4.04,43.66) v1(4.04,42.64) v1(4.04,41.62) v1(4.04,16.61) v1(4.04,15.59) v1(4.04,14.57) v1(4.04,13.56) v1(4.17,30.7) v1(4.17,29.69) v1(4.17,28.67) v1(4.17,27.66) v1(4.3,60.8) v1(4.3,59.91) v1(4.3,59.02) v1(73.64,62.71) v1(73.64,60.93) v1(74.53,62.71) v1(74.53,60.93) v1(75.29,62.71) v1(75.29,60.93) v1(76.18,62.71) v1(76.18,60.93) v1(95.61,58.77) v1(95.61,57.75) v1(95.61,56.74) v1(95.61,55.72) v1(95.61,44.67) v1(95.61,43.66) v1(95.61,42.64) v1(95.61,41.62) v1(95.61,30.7) v1(95.61,29.69) v1(95.61,28.67) v1(95.61,27.66) v1(96.63,58.77) v1(97.64,58.77) v1(97.64,57.75) v1(97.64,56.74) v1(97.64,55.72) v1(97.64,44.67) v1(97.64,43.66) v1(97.64,42.64) v1(97.64,41.62) v1(97.64,30.7) v1(97.64,29.69) v1(97.64,28.67) v1(97.64,27.66) v1(97.64,17.62) v1(97.64,15.84)
ADC_VIN: length 36.1
  Top Layer w0.254: U5.18 45.57,41.21 49.76,45.41 v1(51.34,45.41) ; 62.44,59.07 62.44,56.45 62.45,56.44 62.45,55.18 63.53,54.1 63.53,49.42 59.52,45.41 v1(53.68,45.41)
  Bottom Layer w0.254: v1(51.34,45.41) v1(53.68,45.41)
BOOT0: length 7
  Top Layer w0.254: BOOT0.1 45.41,23.76 R6.2 45.47,23.82 45.47,26.63 46.07,27.22 U5.44
BS: length 2.2
  Top Layer w0.381: U3.1 47.96,57.21 C2.1
CAN1_RX: length 31.1
  Top Layer w0.254: v1(46.36,26.69) 46.57,26.9 U5.45
  Top Layer w0.381: U4.4 59.29,13.43 56.11,10.26 54.13,10.26 53.02,11.37 53.02,24.43 v1(50.7,26.74)
  Bottom Layer w0.254: v1(46.36,26.69) 50.65,26.69 v1(50.7,26.74)
CAN1_TX: length 36.1
  Top Layer w0.254: U5.46 47.07,27.33 47.07,27.32 v1(47.07,26.11)
  Top Layer w0.381: v1(62.41,11.5) 63.81,11.5 63.99,11.68 63.99,13.42 U4.1 ; v1(60.76,11.53) 58.68,11.53 56.77,9.62 53.7,9.62 52.28,11.04 52.28,24.17 v1(50.73,25.72)
  Bottom Layer w0.254: v1(50.73,25.72) 50.35,26.11 v1(47.07,26.11)
  Bottom Layer w0.381: v1(60.76,11.53) 62.39,11.53 v1(62.41,11.5)
CANH: length 7.2
  Top Layer w0.381: R8.1 65.33,8.96 64.85,9.44 63.02,9.44 62.7,9.12 U4.7 62.72,8.05 62.72,5.72
CANL: length 12.9
  Top Layer w0.381: CAN.3 65.17,5.32 66.2,6.35 R8.2 66.2,9.57 65.46,10.31 62.39,10.31 61.43,9.35 U4.6
EEPROM_SCL: length 49.8
  Top Layer w0.254: U17.23 39.7,15.94 v1(40.14,16.38) ; 38.77,16.91 33.99,12.14 23.1,12.14 21.99,11.02 ; 38.77,16.91 39.86,18 39.86,29.77 40.19,30.1 U5.35 ; 38.77,16.91 v1(38.77,17.77)
  Top Layer w0.381: 21.94,5.34 21.99,5.39 U6.6 21.99,11.14 21.34,11.78 19.84,11.78 19.21,11.14 R9.1
  Bottom Layer w0.254: v1(40.14,16.38) 38.77,17.75 v1(38.77,17.77)
EEPROM_SDA: length 46.3
  Top Layer w0.254: U5.36 41.07,18.27 39.2,16.4 ; 39.16,13.66 U17.24 39.2,16.4 ; 39.2,16.4 34.09,11.3 v1(23.47,11.3) ; v1(20.73,10.92) 20.73,9.55 U6.5
  Top Layer w0.381: R10.1 v1(20.71,7.72) 20.72,7.73 U6.5 ; v1(22.97,6.75) 22.97,5.37 22.94,5.34
  Bottom Layer w0.254: v1(20.73,10.92) 23.09,10.92 v1(23.47,11.3)
  Bottom Layer w0.381: v1(20.71,7.72) 22,7.72 v1(22.97,6.75)
FB: length 7.5
  Top Layer w0.381: U3.3 50.21,55.37 50.28,55.29 53.37,55.29 53.62,55.04 54.3,55.04 C1.2 54.45,54.88 R2.2
M0_HO1: length 49.2
  Top Layer w0.381: v1(70.39,47.31) 70.41,47.29 70.41,36.29 69.55,35.43 64.98,35.43 64.34,34.79 v1(64.34,33.04) ; U7.19 63.95,30.92 v1(63.91,30.96) ; v1(75.32,48.56) 77.48,50.72 84.08,50.72 85.12,51.76 R15.1 83.83,57.37 83.59,57.61 D4.1
  Bottom Layer w0.381: v1(75.32,48.56) 74.07,47.31 v1(70.39,47.31) ; v1(64.34,33.04) 63.91,32.61 v1(63.91,30.96)
M0_HO1_1: length 36.3
  Top Layer w0.381: v1(24.08,32.53) 24.08,33.22 22.87,34.44 22.87,41.93 22.18,42.62 19.36,42.62 17.61,40.86 D14.1 16.41,40.9 16.41,42.39 15.91,42.89 R32.1 ; U11.19 34.21,24.98 v1(32.62,26.56)
  Bottom Layer w0.381: v1(24.08,32.53) 25.51,32.53 29.09,28.95 29.09,27.32 29.85,26.56 v1(32.62,26.56)
M0_HO2: length 37.9
  Top Layer w0.381: U7.16 65.9,27.98 v1(67.11,26.77) ; v1(75.29,30.19) 75.29,42.26 78.47,45.44 D5.1 83.59,43.97 84.16,43.4 R16.1
  Bottom Layer w0.381: v1(75.29,30.19) 69.8,30.19 67.11,27.5 v1(67.11,26.77)
M0_HO2_1: length 21.3
  Top Layer w0.381: U11.16 32.26,24.82 30.36,26.71 v1(27.11,26.71) ; R34.1 16.36,28.92 16.62,28.67 16.62,26.94 D16.1 16.75,26.71 v1(20.3,26.71)
  Bottom Layer w0.381: v1(27.11,26.71) v1(20.3,26.71)
M0_HO3: length 25.3
  Top Layer w0.381: 85.09,29.41 83.88,29.41 83.59,29.69 D6.1 ; 85.09,29.41 R17.1 ; 85.09,29.41 85.09,28.19 84.38,27.48 83.55,27.48 82.48,28.54 v1(75.29,28.54) ; v1(70.14,27.1) 68.66,27.1 67.85,27.91 U7.13
  Bottom Layer w0.381: v1(75.29,28.54) 70.87,28.54 70.14,27.81 v1(70.14,27.1)
M0_HO3_1: length 26.6
  Top Layer w0.381: v1(29.93,19.81) 29.93,21.58 30.31,21.96 30.31,23.49 ; v1(29.93,18.44) 30.38,17.98 30.38,16.07 29.01,14.7 27.89,14.7 26.64,13.46 17.99,13.46 17.38,12.84 D18.1 16.4,14.66 16.06,15 R36.1
  Bottom Layer w0.381: v1(29.93,19.81) v1(29.93,18.44)
M0_IN1: length 8.2
  Top Layer w0.381: v1(65.28,22.3) 65.25,22.33 U7.4 ; U7.1 63.26,23.47 R12.2 61.24,22.96 61.47,22.73 v1(62.36,22.73)
  Bottom Layer w0.381: v1(65.28,22.3) 64.85,22.73 v1(62.36,22.73)
M0_IN1_1: length 7.6
  Top Layer w0.381: 34.86,30.65 34.88,30.63 v1(35.41,30.63) ; 34.86,30.65 34.86,31.07 R42.2 ; 34.86,30.65 U11.1 ; U11.4 v1(32.91,30.63)
  Bottom Layer w0.381: v1(35.41,30.63) v1(32.91,30.63)
M0_IN2: length 8
  Top Layer w0.381: U7.5 65.89,23.53 65.89,24.4 65.51,24.78 64.36,24.78 63.98,24.4 63.98,23.49 U7.2 63.95,22.56 63.34,21.95 R13.2
M0_IN2_1: length 6.9
  Top Layer w0.381: U11.5 32.26,28.17 32.44,27.98 33.86,27.98 34.22,28.34 34.22,29.22 U11.2 34.21,31.94 R43.2
M0_IN3: length 9.2
  Top Layer w0.381: 64.6,21.97 U7.3 ; 64.6,21.97 65.11,21.46 65.55,21.46 66.55,22.46 66.55,23.52 ; 64.6,21.97 63.06,20.43 R14.2
M0_IN3_1: length 7.1
  Top Layer w0.381: U11.3 33.56,31.67 33.25,31.98 31.96,31.98 31.6,31.62 31.6,29.24 31.61,29.23
M0_IN_IU: length 14.7
  Top Layer w0.381: v1(75.37,43.4) 77.4,45.44 77.4,47.57 77.81,47.97 R21.2 ; 69.02,42.54 U8.4
  Bottom Layer w0.381: v1(69.02,42.54) 74.5,42.54 v1(75.37,43.4)
M0_IN_IU_1: length 14.7
  Top Layer w0.381: v1(24.82,49.52) 20.91,49.52 20.55,49.88 20.55,52.37 R40.2 ; v1(28.83,49.52) 29.47,49.52 30.16,48.83 U12.4
  Bottom Layer w0.381: v1(24.82,49.52) v1(28.83,49.52)
M0_IN_IV: length 15.8
  Top Layer w0.381: v1(69.7,37.23) 69.7,38.12 68.74,39.08 68.74,39.75 U9.4 ; v1(79.05,37.23) 79.41,36.87 R22.2
  Bottom Layer w0.381: v1(69.7,37.23) v1(79.05,37.23)
M0_IN_IV_1: length 14.9
  Top Layer w0.381: U13.4 29.35,43.97 28.86,43.48 v1(28.86,41.52) ; R41.2 20.63,40.94 21.24,41.55 v1(22.18,41.55)
  Bottom Layer w0.381: v1(28.86,41.52) 28.83,41.55 v1(22.18,41.55)
M0_IU: length 29
  Top Layer w0.254: U8.6 68.23,43.85 68.23,44.55 67.98,44.8 61.09,44.8 60.58,44.29 60.58,39.82 57.97,37.21 50.32,37.21 49.41,38.12 47.86,38.12 47.57,37.83 U5.14
M0_IU_1: length 27.3
  Top Layer w0.254: U5.16 46.57,38.46 v1(48.44,40.33)
  Top Layer w0.381: v1(41.41,38.63) 35.74,38.63 v1(33.1,41.27) ; U12.6 30.16,44.92 30.36,44.72 v1(30.77,44.72)
  Bottom Layer w0.381: v1(41.41,38.63) 44.48,38.63 46.18,40.33 v1(48.44,40.33) ; v1(33.1,41.27) 33.1,42.39 v1(30.77,44.72)
M0_IV: length 37.8
  Top Layer w0.254: U9.6 69.44,41.06 69.78,41.4 69.78,46.04 68.94,46.88 61.85,46.88 59.85,44.88 59.85,40.13 57.51,37.79 51.01,37.79 50.04,38.75 47.45,38.75 47.07,38.37 U5.15
M0_IV_1: length 21.8
  Top Layer w0.254: U5.17 46.07,39.02 v1(46.61,39.57)
  Top Layer w0.381: U13.6 35.42,37.92 v1(41.74,37.92)
  Bottom Layer w0.381: v1(46.61,39.57) 44.96,37.92 v1(41.74,37.92)
M0_LO1: length 35
  Top Layer w0.381: R18.1 76.94,52.55 76.73,52.76 D7.1 75.8,54.71 75.32,54.22 v1(75.32,49.6) ; v1(70.8,48.51) 71.18,48.13 71.18,32.94 69.15,30.91 U7.11
  Bottom Layer w0.381: v1(70.8,48.51) 71.89,49.6 v1(75.32,49.6)
M0_LO1_1: length 31
  Top Layer w0.381: v1(24.85,31.29) 24.85,45.31 24.47,45.69 D15.1 23.18,47.26 22.71,47.72 R33.1 ; v1(27.16,25.09) 28.66,25.09 29.01,24.74 29.01,23.49
  Bottom Layer w0.381: v1(24.85,31.29) 25.76,31.29 28.28,28.77 28.28,26.21 v1(27.16,25.09)
M0_LO2: length 24.7
  Top Layer w0.381: v1(71.2,26.89) 69.15,24.84 U7.10 ; D8.1 76.73,39.04 77.32,38.45 R19.1 ; v1(77.45,30.07) 77.42,30.09 77.42,36.21 78.26,37.05 78.26,38.45
  Bottom Layer w0.381: v1(71.2,26.89) 75.77,26.89 77.45,28.57 v1(77.45,30.07)
M0_LO2_1: length 12.2
  Top Layer w0.381: v1(23.17,30.6) 23.18,30.61 D17.1 23.17,31.6 23.17,33.12 22.53,33.75 R35.1 ; v1(27.54,28.09) 28.83,28.09 29.01,28.26 29.01,29.23
  Bottom Layer w0.381: v1(23.17,30.6) 25.02,30.6 v1(27.54,28.09)
M0_LO3: length 15.9
  Top Layer w0.381: v1(75.34,22.45) 77.02,22.45 78.11,23.54 78.11,24.58 R20.1 77.07,24.61 76.6,25.07 76.6,26.64 ; v1(70.92,21.91) 69.07,21.91 68.5,22.48 U7.9
  Bottom Layer w0.381: v1(75.34,22.45) 74.81,21.91 v1(70.92,21.91)
M0_LO3_1: length 17.6
  Top Layer w0.381: U11.9 29.65,29.22 29.65,27.76 29.29,27.4 26.85,27.4 21.63,22.18 R37.1 22.75,19.75 23.09,19.4 23.09,17.71 D19.1
M0_UOUT: length 52.2
  Top Layer w0.381: C18.1 64.2,32.2 64.6,31.79 U7.18 64.6,29.26 v1(64.6,27.78) ; v1(76.43,30.88) v1(76.43,36.34) ; 81.26,36.7 81.29,36.7 v1(81.34,36.65) 83.77,36.65 85.12,37.99 85.12,40.81 86.39,42.08 90.73,42.08 91.62,42.97 91.62,47.81 Q4.2
  Bottom Layer w0.381: v1(81.34,36.65) 81.03,36.34 v1(76.43,36.34) ; v1(76.43,30.88) 69.14,30.88 66.05,27.78 v1(64.6,27.78)
M0_UOUT_1: length 42.8
  Top Layer w0.381: Q7.3 16.71,45.42 18.34,43.78 22.46,43.78 23.96,42.29 v1(23.96,34.84) ; v1(30.41,27.58) 33.56,24.43 U11.18 33.56,19.66 33.89,19.32 34.84,19.32 C31.1
  Bottom Layer w0.381: v1(23.96,34.84) 24.44,34.84 30.41,28.87 v1(30.41,27.58)
M0_VB1: length 4.1
  Top Layer w0.381: C18.2 63.1,30.45 63.3,30.25 U7.20 63.28,29.24 D1.1
M0_VB1_1: length 5.7
  Top Layer w0.381: U11.20 34.85,23.49 C31.2
  Top Layer w0.508: D11.1 35.06,23.18
M0_VB2: length 4.8
  Top Layer w0.381: U7.17 65.25,31.55 C19.2
  Top Layer w0.508: C19.2 65.39,31.69 D2.1
M0_VB2_1: length 6.7
  Top Layer w0.381: U11.17 32.91,21.49 32.63,21.21 C32.2 32.7,19.64 D12.1
M0_VB3: length 5.8
  Top Layer w0.381: D3.1 C20.2 68.55,32.58 67.72,32.58 67.2,32.06 U7.14
M0_VB3_1: length 8.1
  Top Layer w0.381: D13.1 29.14,19.14 C30.2 29.18,19.15 30.33,19.15 30.58,19.39 30.58,20.12 30.96,20.51 U11.14
M0_VOUT: length 34.6
  Top Layer w0.381: v1(69.12,26.28) 68.58,26.28 66.55,28.31 66.55,31.54 C19.1 ; v1(75.29,29.36) 81.79,29.36 v1(81.82,29.38) ; v1(84.89,31.01) 85.22,31.34 85.22,35.78 85.6,36.16 Q5.2
  Bottom Layer w0.381: v1(75.29,29.36) 70.49,29.36 69.12,27.98 v1(69.12,26.28) ; v1(84.89,31.01) 83.27,29.38 v1(81.82,29.38)
M0_VOUT_1: length 29.8
  Top Layer w0.381: v1(19.18,27.55) 19.18,28.59 16.34,31.44 10.87,31.44 Q9.3 ; C32.1 31.61,19.78 31.61,24.5 30.15,25.95 v1(26.37,25.95)
  Bottom Layer w0.381: v1(19.18,27.55) 19.18,26.36 19.59,25.95 v1(26.37,25.95)
M0_VS3: length 24.6
  Top Layer w0.381: v1(71.2,27.76) 68.95,27.76 68.5,28.2 U7.12 68.5,31.43 C20.1 ; v1(75.29,27.78) 82.17,27.78 83.09,26.86 Q3.3
  Bottom Layer w0.381: v1(75.29,27.78) 75.27,27.76 v1(71.2,27.76)
M0_VS3_1: length 23.8
  Top Layer w0.381: Q11.3 16.89,17.42 17.96,16.35 23.8,16.35 27.71,20.25 C30.1 29.16,20.26 29.16,21.97 29.66,22.46 U11.12
NRST: length 32
  Top Layer w0.254: v1(59.36,46.2) 62.3,49.13 NRST.1 ; v1(51.14,32.71) 51.03,32.6 U5.7 ; v1(53.47,38.37) 57.28,38.37 59.24,40.33 59.24,44.37 v1(58.91,44.7)
  Top Layer w0.381: C11.2 v1(52.08,33.67)
  Bottom Layer w0.254: 52.05,33.62 v1(51.14,32.71) ; v1(58.91,44.7) 59.36,45.16 v1(59.36,46.2)
  Bottom Layer w0.381: v1(53.47,38.37) 53.47,34.26 52.86,33.65 52.1,33.65 v1(52.08,33.67)
OSC_IN: length 6.3
  Top Layer w0.254: C14.2 52.42,29.76 X2.1 51.47,29.76 51.16,30.07 51.16,31.34 50.89,31.6 U5.5
OSC_OUT: length 4.8
  Top Layer w0.254: U5.6 52.36,32.1 X2.3 52.43,32.15 C12.1
PA0: length 35.1
  Top Layer w0.254: v1(58.78,20.09) 58.81,20.11 58.81,24.87 57.46,26.21 57.46,33.8 56.14,35.12 51.36,35.12 50.35,34.1 U5.10 ; 54.92,19.5 54.92,19.5 KEY1.1 KEY2.1 54.95,14.98 KEY3.1
  Bottom Layer w0.254: v1(58.78,20.09) 55.5,20.09 v1(54.95,19.53)
PA1: length 24
  Top Layer w0.254: U5.11 50.29,34.6 51.24,35.55 56.39,35.55 58.02,33.93 58.02,26.54 59.29,25.27 59.29,21.51 R14.1
PA2: length 23.5
  Top Layer w0.254: U5.12 49.57,35.69 49.94,36.06 56.67,36.06 58.6,34.13 58.6,26.74 59.77,25.57 59.77,22.55 R13.1
PA3: length 23.4
  Top Layer w0.254: R12.1 60.38,25.73 59.11,26.99 59.11,34.39 56.89,36.6 U5.13
PA8: length 9.5
  Top Layer w0.254: U5.29 40.1,33.1 39.32,33.88 33.23,33.88 32.57,33.22 R44.1
PA9: length 7.4
  Top Layer w0.254: R43.1 34.73,32.84 35.31,33.42 39.1,33.42 39.91,32.6 U5.30
PA10: length 5.6
  Top Layer w0.254: U5.31 39.65,32.1 38.91,32.84 R42.1
PA13: length 31.8
  Top Layer w0.254: U5.34 41.86,30.6 42.12,30.35 42.12,19.58 45.9,15.79 45.9,10.61 42.1,6.81 39.75,6.81 39.49,6.55 SWD.3
PA14: length 27.6
  Top Layer w0.254: SWD.4 41.57,5.32 46.59,10.34 46.59,15.97 42.55,20.01 42.55,28.09 U5.37
PB1: length 26
  Top Layer w0.254: v1(51.34,46.22) 49.76,46.22 45.07,41.53 U5.19 ; v1(53.68,46.22) 57.92,46.22 58.72,47.03 LED2.1
  Bottom Layer w0.254: v1(53.68,46.22) v1(51.34,46.22)
PB6: length 26.2
  Top Layer w0.254: USART1.3 50.7,6.39 47.38,9.72 47.38,16 43.72,19.65 43.72,26.05 45.07,27.4 U5.42
PB7: length 26.4
  Top Layer w0.254: USART1.4 51.7,6.34 47.91,10.13 47.91,16.28 44.28,19.91 44.28,25.94 45.57,27.23 U5.43
PB10: length 66.3
  Top Layer w0.254: v1(48.37,30.37) 45.83,32.91 45.83,34 44.07,35.76 U5.21 44.07,42.75 v1(41.79,45.03)
  Top Layer w0.381: IIC2.3 78.84,7.77 R47.1 78.72,8.71 75.06,12.36 68.56,12.36 66.38,14.55 66.38,17.04 64.9,18.51 57.43,18.51 53.83,22.12 53.83,24.81 v1(50.81,27.83)
  Bottom Layer w0.254: v1(41.79,45.03) 39.87,45.03 U16.3
  Bottom Layer w0.381: v1(48.37,30.37) 49.84,30.37 51.11,29.1 51.11,28.14 v1(50.81,27.83)
PB11: length 68.2
  Top Layer w0.254: U16.4 39.89,47.56 41.15,46.3 41.15,42.18 43.57,39.77 U5.22 43.57,35.58 45.24,33.9 45.24,32.56 v1(47.15,30.65)
  Top Layer w0.381: 79.94,7.88 79.94,9.19 75.93,13.2 69.2,13.2 67.21,15.18 67.21,17.37 65.23,19.35 58.04,19.35 54.77,22.63 54.77,24.94 51.01,28.7 v1(50.27,28.7) ; IIC2.4 79.94,5.42 R48.1
  Bottom Layer w0.381: v1(50.27,28.7) 49.1,28.7 v1(47.15,30.65)
SW: length 7.3
  Top Layer w0.508: L1.1 41.46,58.3 C2.2 46.27,58.36 47.02,58.36 47.81,59.16 U3.6
VREF: length 12.6
  Top Layer w0.381: U9.1 65.86,41.06 v1(65.41,40.61) ; 61.59,41.7 61.6,41.69 61.6,40.81 61.8,40.61 v1(63.71,40.61) ; 61.59,41.7 R24.1 61.58,42.95 61.58,43.45 61.96,43.84 U8.1 ; 61.59,41.7 R23.2
  Bottom Layer w0.381: v1(65.41,40.61) v1(63.71,40.61)
VREF_1: length 10.3
  Top Layer w0.381: U12.1 32.46,44.87 31.86,44.27 31.86,43.07 32.26,42.67 32.97,42.67 U13.1 36.89,42.67 37.17,42.95 37.17,43.41 R39.1 R38.2
$1N6913: length 1.9
  Top Layer w0.508: R11.2 46.13,54.25 46.62,53.76 LED1.2
$1N15344: length 3.5
  Top Layer w0.254: LED2.2 60.32,53.55 59.86,54.01 R25.2
$1N20985: length 6.6
  Top Layer w0.381: R31.1 50.99,18.52 KEY1.2 49.74,18.38 49.43,18.08 R27.2
$1N20991: length 5
  Top Layer w0.381: R27.1 49.43,15.31 49.74,15.01 KEY2.2 50.78,14.93 50.78,13.94 50.6,13.76 R28.2
$1N21003: length 5
  Top Layer w0.254: R30.2 50.86,11.6 KEY3.2
  Top Layer w0.381: KEY3.2 49.64,11.63 49.46,11.81 R28.1
$1N40980: length 1.5
  Top Layer w0.254: U17.10 40.7,9.34 41.15,8.88 41.15,8.46 C42.1
$1N41089: length 1.3
  Top Layer w0.254: C43.2 41.2,15 U17.20

## Copper pours and planes (outline as drawn; the poured copper is in the pictures)
GND on Top Layer: -0.78,70.38 100.41,70.38 100.41,-0.89 -0.78,-0.89
GND on Bottom Layer: -0.78,70.38 100.41,70.38 100.41,-0.89 -0.78,-0.89
M0_IN_IU on Top Layer: 84.18,49.02 82.02,49.02 81.13,49.91 78.08,49.91 78.08,46.09 81.26,46.09 81.89,46.73 84.18,46.73
M0_IN_IU_1 on Top Layer: 15.78,51.3 17.94,51.3 18.7,50.54 21.87,50.54 21.87,54.35 18.83,54.35 18.06,53.58 15.78,53.58
M0_IN_IV on Top Layer: 84.22,34.96 82.06,34.96 81.17,35.84 78.12,35.84 78.12,32.03 81.3,32.03 81.93,32.67 84.22,32.67
M0_IN_IV_1 on Top Layer: 15.85,37.31 18.01,37.31 18.78,36.55 21.95,36.55 21.95,40.35 18.9,40.35 18.14,39.59 15.85,39.59
M0_UOUT on Top Layer: 87.74,55.72 90.78,55.72 90.78,52.29 87.74,52.29
M0_UOUT on Top Layer: 85.96,53.31 99.67,53.31 99.67,47.21 85.96,47.21
M0_UOUT_1 on Top Layer: 14.17,47.04 0.45,47.04 0.45,53.14 14.17,53.14
M0_UOUT_1 on Top Layer: 12.39,44.63 9.21,44.63 9.21,48.06 12.39,48.06
M0_VOUT on Top Layer: 87.65,41.67 90.7,41.67 90.7,38.24 87.65,38.24
M0_VOUT on Top Layer: 85.87,39.26 99.59,39.26 99.59,33.16 85.87,33.16
M0_VOUT_1 on Top Layer: 14.15,33.07 0.44,33.07 0.44,39.17 14.15,39.17
M0_VOUT_1 on Top Layer: 12.38,30.66 9.33,30.66 9.33,34.09 12.38,34.09
M0_VS3 on Top Layer: 85.82,25.24 99.53,25.24 99.53,19.15 85.82,19.15
M0_VS3 on Top Layer: 87.72,27.66 90.77,27.66 90.77,24.23 87.72,24.23
M0_VS3_1 on Top Layer: 12.36,16.67 9.32,16.67 9.32,20.1 12.36,20.1
M0_VS3_1 on Top Layer: 14.14,19.09 0.43,19.09 0.43,25.18 14.14,25.18
$2N1251 on Top Layer: 87.85,56.58 86.47,56.58 86.47,60.17 90.66,60.17 90.66,58.84 87.86,58.84 87.86,56.6
$2N1356 on Top Layer: 80.88,55.47 79.5,55.47 79.5,51.76 84.07,51.76 84.07,53.21 80.9,53.21 80.9,55.45
$2N1706 on Top Layer: 87.85,42.49 86.47,42.49 86.47,46.07 90.66,46.07 90.66,44.74 87.86,44.74 87.86,42.5
$2N1723 on Top Layer: 80.87,41.37 79.49,41.37 79.49,37.66 84.06,37.66 84.06,39.12 80.88,39.12 80.88,41.35
$2N1987 on Top Layer: 87.8,28.47 86.42,28.47 86.42,32.05 90.61,32.05 90.61,30.73 87.81,30.73 87.81,28.49
$2N2004 on Top Layer: 80.75,27.4 79.37,27.4 79.37,23.69 83.94,23.69 83.94,25.15 80.77,25.15 80.77,27.38
$2N16058 on Top Layer: 12.19,43.81 13.57,43.81 13.57,40.23 9.38,40.23 9.38,41.56 12.17,41.56 12.17,43.8
$2N16063 on Top Layer: 19.04,44.93 20.42,44.93 20.42,48.64 15.85,48.64 15.85,47.18 19.03,47.18 19.03,44.94
$2N16067 on Top Layer: 12.27,29.8 13.65,29.8 13.65,26.21 9.45,26.21 9.45,27.54 12.25,27.54 12.25,29.78
$2N16072 on Top Layer: 19.03,30.96 20.41,30.96 20.41,34.67 15.84,34.67 15.84,33.21 19.01,33.21 19.01,30.97
$2N16077 on Top Layer: 12.25,15.81 13.63,15.81 13.63,12.23 9.44,12.23 9.44,13.56 12.24,13.56 12.24,15.8
$2N16082 on Top Layer: 19,16.91 20.38,16.91 20.38,20.62 15.8,20.62 15.8,19.16 18.98,19.16 18.98,16.92

Small or netless copper shapes (teardrops, artwork), in the pictures only: 447 on Top Layer, 94 on Bottom Layer

## Text on the board
Bottom Silkscreen Layer: KEY(PA0) / LED(PB1) / BATTERY(PB0) / MOTOR1(PA8 PA9 PA10) / MOTOR2(PA1 PA2 PA3) / I-SENSE1(PA6 PA7) / I-SENSE2(PA4 PA5) / IIC1(PF6-SCL PF7-SDA)-MPU-FLASH / IIC2(PB10-SCL PB11-SDA)-OLED / SWD(PA13-CLK PA14-DIO) / USART1(PB6-TX PB7-RX) / CAN(PB8-RX PB9-TX)
Top Silkscreen Layer: G3CD | G3TR | GHL | 12V | + | - | 斓
